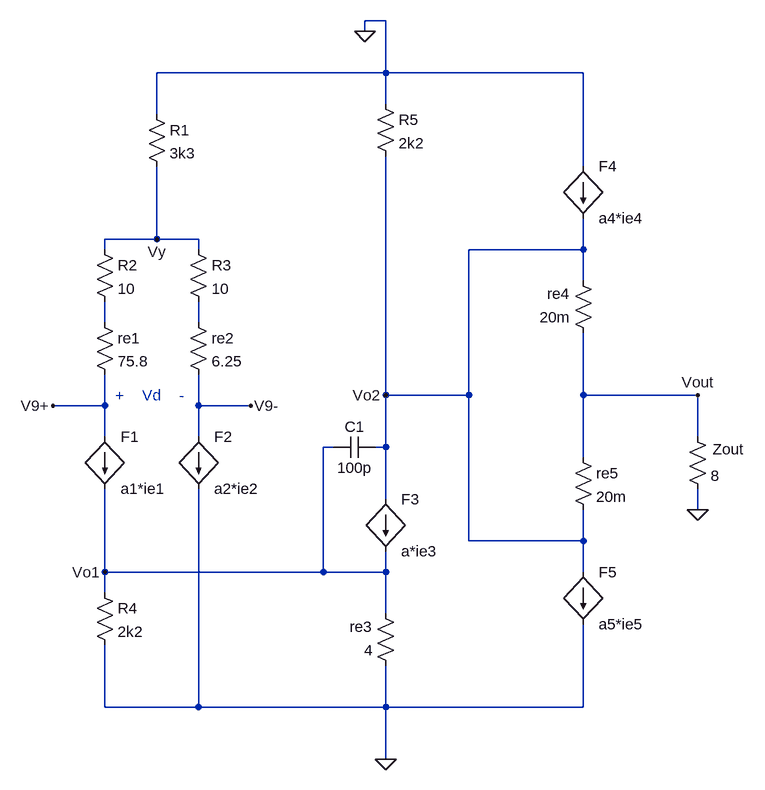
[diagram p0: schematic Amp_base_CA_Modo_Diferencial.asc]
Amp_base_CA_Modo_Diferencial.asc, the LTspice schematic file:
Version 4.1
SHEET 1 1512 984
WIRE 400 -416 368 -416
WIRE 368 -400 368 -416
WIRE 400 -336 400 -416
WIRE 400 -336 48 -336
WIRE 704 -336 400 -336
WIRE 400 -288 400 -336
WIRE 48 -272 48 -336
WIRE 704 -192 704 -336
WIRE 48 -80 48 -192
WIRE 48 -80 -32 -80
WIRE 112 -80 48 -80
WIRE -32 -64 -32 -80
WIRE 112 -64 112 -80
WIRE 704 -64 704 -112
WIRE 704 -64 528 -64
WIRE 704 -16 704 -64
WIRE -32 48 -32 16
WIRE 112 48 112 16
WIRE 400 160 400 -208
WIRE 528 160 528 -64
WIRE 528 160 400 160
WIRE 704 160 704 64
WIRE 880 160 704 160
WIRE -32 176 -32 128
WIRE -32 176 -112 176
WIRE 112 176 112 128
WIRE 192 176 112 176
WIRE -32 224 -32 176
WIRE 112 224 112 176
WIRE 880 224 880 160
WIRE 320 240 304 240
WIRE 400 240 400 160
WIRE 400 240 384 240
WIRE 704 256 704 160
WIRE 400 320 400 240
WIRE 880 336 880 304
WIRE 528 384 528 160
WIRE 704 384 704 336
WIRE 704 384 528 384
WIRE -32 432 -32 304
WIRE 304 432 304 240
WIRE 304 432 -32 432
WIRE 400 432 400 400
WIRE 400 432 304 432
WIRE 704 432 704 384
WIRE -32 464 -32 432
WIRE 400 496 400 432
WIRE -32 640 -32 544
WIRE 112 640 112 304
WIRE 112 640 -32 640
WIRE 400 640 400 576
WIRE 400 640 112 640
WIRE 704 640 704 512
WIRE 704 640 400 640
WIRE 400 720 400 640
FLAG 880 160 Vout
FLAG 880 336 0
FLAG 368 -400 0
FLAG 400 720 0
FLAG -32 432 Vo1
FLAG 400 160 Vo2
FLAG 48 -80 Vy
FLAG -112 176 V9+
FLAG 192 176 V9-
SYMBOL res 32 -288 R0
SYMATTR InstName R1
SYMATTR Value 3k3
SYMBOL res -48 -80 R0
SYMATTR InstName R2
SYMATTR Value 10
SYMBOL res 96 -80 R0
SYMATTR InstName R3
SYMATTR Value 10
SYMBOL res -48 448 R0
SYMATTR InstName R4
SYMATTR Value 2k2
SYMBOL res 384 -304 R0
SYMATTR InstName R5
SYMATTR Value 2k2
SYMBOL cap 384 224 R90
WINDOW 0 0 32 VBottom 2
WINDOW 3 32 32 VTop 2
SYMATTR InstName C1
SYMATTR Value 100p
SYMBOL res 864 208 R0
WINDOW 0 39 35 Left 2
SYMATTR InstName Zout
SYMATTR Value 8
SYMBOL f -32 224 R0
SYMATTR InstName F1
SYMATTR Value a1*ie1
SYMBOL f 112 224 R0
SYMATTR InstName F2
SYMATTR Value a2*ie2
SYMBOL res -48 32 R0
SYMATTR InstName re1
SYMATTR Value 75.8
SYMBOL res 96 32 R0
SYMATTR InstName re2
SYMATTR Value 6.25
SYMBOL f 400 320 R0
SYMATTR InstName F3
SYMATTR Value a*ie3
SYMBOL res 416 592 R180
WINDOW 0 36 76 Left 2
WINDOW 3 36 40 Left 2
SYMATTR InstName re3
SYMATTR Value 4
SYMBOL f 704 -192 R0
SYMATTR InstName F4
SYMATTR Value a4*ie4
SYMBOL res 720 80 R180
WINDOW 0 36 76 Left 2
WINDOW 3 36 40 Left 2
SYMATTR InstName re4
SYMATTR Value 20m
SYMBOL f 704 432 R0
SYMATTR InstName F5
SYMATTR Value a5*ie5
SYMBOL res 688 240 R0
SYMATTR InstName re5
SYMATTR Value 20m
TEXT -16 160 Left 2 ;+    Vd    -

The netlist it stands for:
* Amp_base_CA_Modo_Diferencial.asc
R1 0 Vy 3k3
R2 Vy N001 10
R3 Vy N002 10
R4 Vo1 0 2k2
R5 0 Vo2 2k2
C1 Vo2 Vo1 100p
R§Zout Vout 0 8
F1 V9+ Vo1 a1*ie1
F2 V9- 0 a2*ie2
re1 N001 V9+ 75.8
re2 N002 V9- 6.25
F3 Vo2 Vo1 a*ie3
re3 0 Vo1 4
F4 0 Vo2 a4*ie4
re4 Vout Vo2 20m
F5 Vo2 0 a5*ie5
re5 Vout Vo2 20m
* +    Vd    -
.backanno
.end